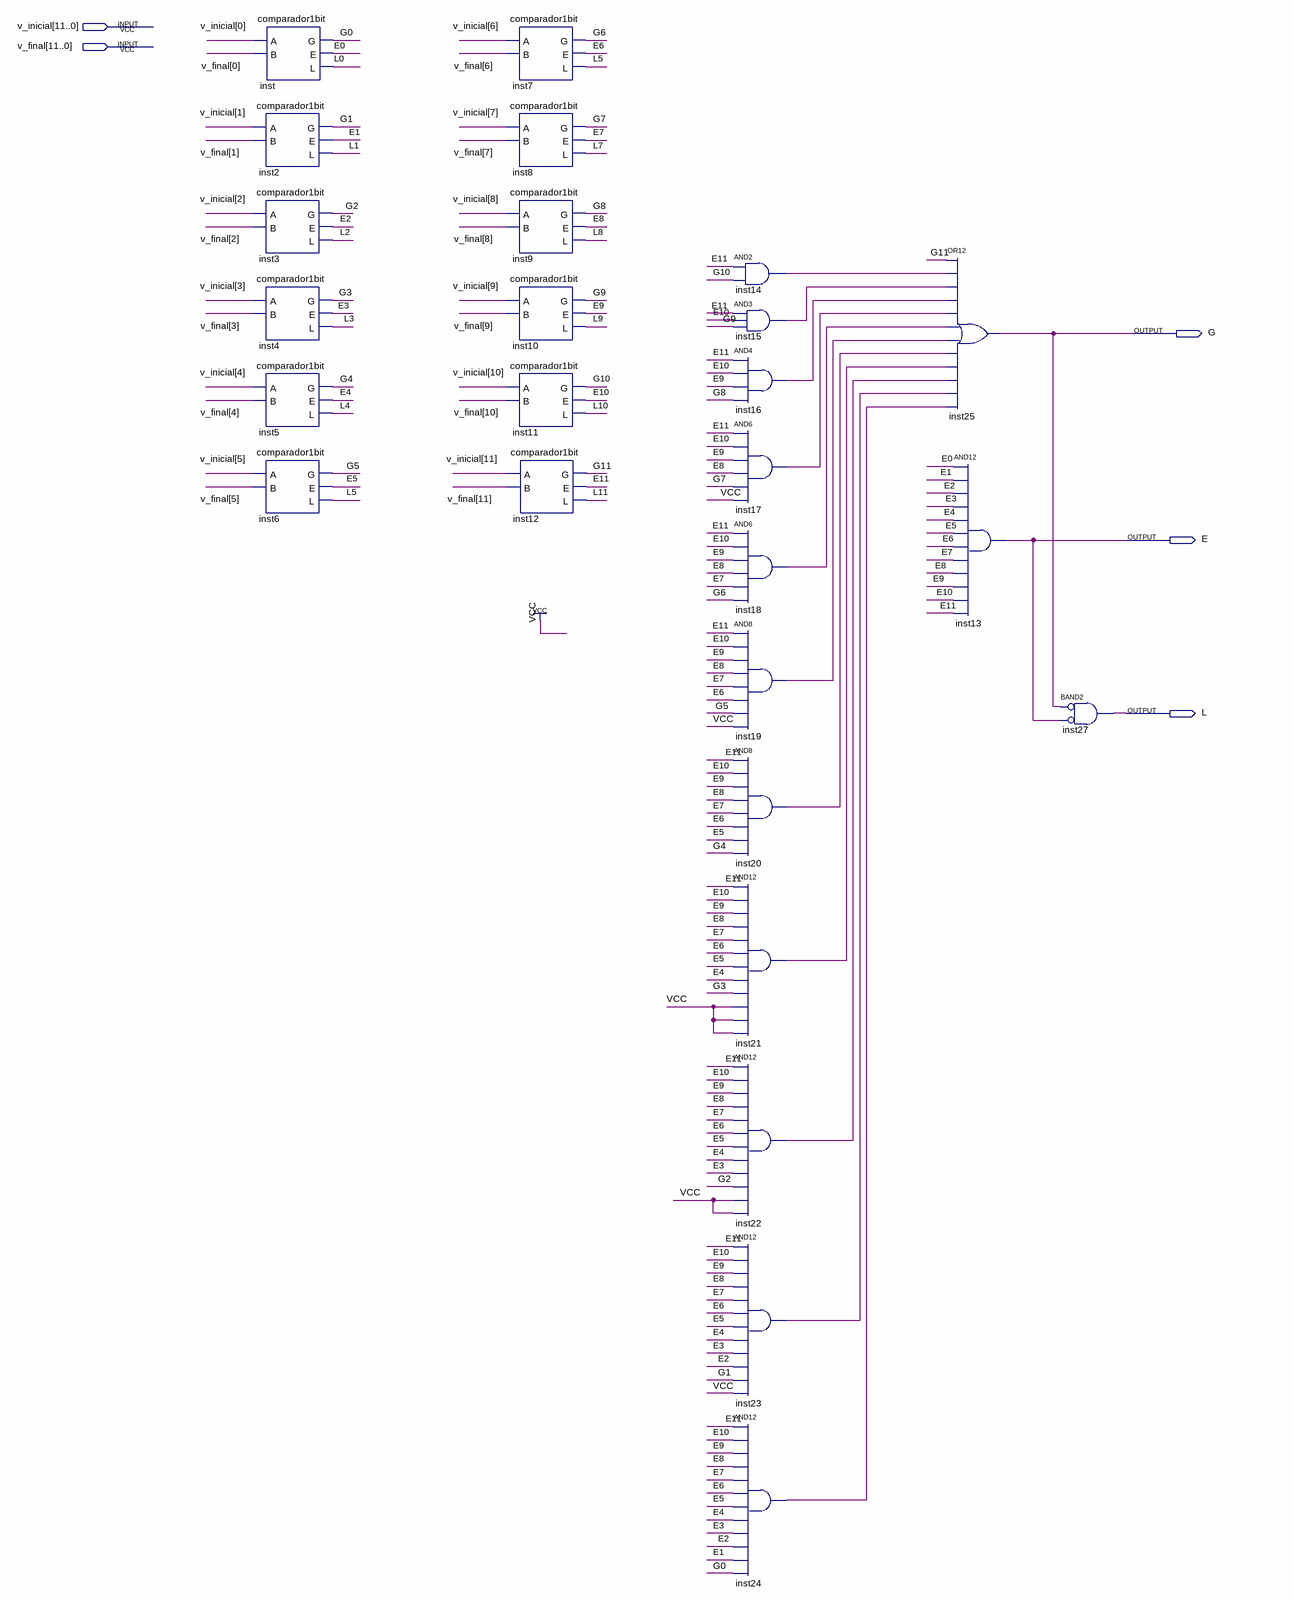
[diagram p0: schematic sheet]
// Quartus schematic comparador12bits.bdf as structural Verilog: 26 symbols, 5 pins
module comparador12bits (
  input  [11:0] v_inicial,
  input  [11:0] v_final,
  output G,
  output E,
  output L
);

  wire E0, E1, E2, E3, E4, E5, E6, E7, E8, E9, E10, E11, G0, G1, G2, G3, G4, G5, G6, G7, G8, G9, G10, G11,
       inst14_out, inst15_out, inst16_out, inst17_out, inst18_out, inst19_out, inst20_out, inst21_out,
       inst22_out, inst23_out, inst24_out, L0, L1, L2, L3, L4, L5, L7, L8, L9, L10, L11;

  comparador1bit inst (.A(v_inicial[0]), .B(v_final[0]), .G(G0), .E(E0), .L(L0));
  comparador1bit inst2 (.A(v_inicial[1]), .B(v_final[1]), .G(G1), .E(E1), .L(L1));
  comparador1bit inst3 (.A(v_inicial[2]), .B(v_final[2]), .G(G2), .E(E2), .L(L2));
  comparador1bit inst4 (.A(v_inicial[3]), .B(v_final[3]), .G(G3), .E(E3), .L(L3));
  comparador1bit inst5 (.A(v_inicial[4]), .B(v_final[4]), .G(G4), .E(E4), .L(L4));
  comparador1bit inst6 (.A(v_inicial[5]), .B(v_final[5]), .G(G5), .E(E5), .L(L5));
  comparador1bit inst7 (.A(v_inicial[6]), .B(v_final[6]), .G(G6), .E(E6), .L(L5));
  comparador1bit inst8 (.A(v_inicial[7]), .B(v_final[7]), .G(G7), .E(E7), .L(L7));
  comparador1bit inst9 (.A(v_inicial[8]), .B(v_final[8]), .G(G8), .E(E8), .L(L8));
  comparador1bit inst10 (.A(v_inicial[9]), .B(v_final[9]), .G(G9), .E(E9), .L(L9));
  comparador1bit inst11 (.A(v_inicial[10]), .B(v_final[10]), .G(G10), .E(E10), .L(L10));
  comparador1bit inst12 (.A(v_inicial[11]), .B(v_final[11]), .G(G11), .E(E11), .L(L11));
  and inst14 (inst14_out, E11, G10);
  and inst15 (inst15_out, E11, E10, G9);
  and inst16 (inst16_out, E11, E10, E9, G8);
  and inst17 (inst17_out, E11, E10, E9, E8, G7, 1'b1);
  and inst18 (inst18_out, E11, E10, E9, E8, E7, G6);
  and inst19 (inst19_out, E11, E10, E9, E8, E7, E6, G5, 1'b1);
  and inst20 (inst20_out, E11, E10, E9, E8, E7, E6, E5, G4);
  and inst21 (inst21_out, E11, E10, E9, E8, E7, E6, E5, E4, G3, 1'b1, 1'b1, 1'b1);
  and inst22 (inst22_out, E11, E10, E9, E8, E7, E6, E5, E4, E3, G2, 1'b1, 1'b1);
  and inst23 (inst23_out, E11, E10, E9, E8, E7, E6, E5, E4, E3, E2, G1, 1'b1);
  and inst24 (inst24_out, E11, E10, E9, E8, E7, E6, E5, E4, E3, E2, E1, G0);
  or inst25 (G, G11, inst14_out, inst15_out, inst16_out, inst17_out, inst18_out, inst19_out, inst20_out, inst21_out, inst22_out, inst23_out, inst24_out);
  and inst13 (E, E0, E1, E2, E3, E4, E5, E6, E7, E8, E9, E10, E11);
  and inst27 (L, ~G, ~E);  // BAND2
endmodule
